# Altium schematic sheet Sheet1 - Copy.SchDoc
size A
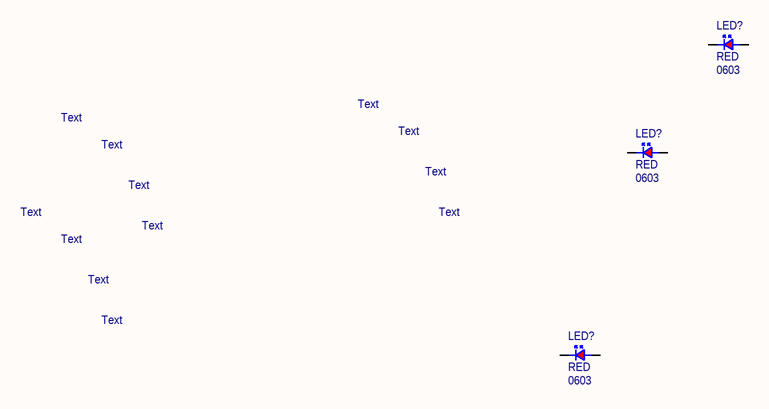
[diagram p0: Sheet1 - Copy.SchDoc]

## Parts
(Parts that share a designator on the sheet are numbered #1, #2 ... from top to bottom, then left to right.)
LED?#1  PackageReference: 0603  [LED0603_RED_LTST]  (hidden comment: RED)
LED?#2  PackageReference: 0603  [LED0603_RED_LTST]  (hidden comment: RED)
LED?#3  PackageReference: 0603  [LED0603_RED_LTST]  (hidden comment: RED)

## Nets

Not connected (* = marked no-connect by the designer): LED?#1 1(K) 2(A); LED?#2 1(K) 2(A); LED?#3 1(K) 2(A)

## Notes on the sheet
- Text

## Library data of the parts
LED?#1-LED?#3 = E1052: LED RED CLEAR SMD 2V 0603; KEY: E1052; n: 53; item_category: Diodes; OpTemp: -55~85C; MaxHeightAboveBoard: 0.55mm; MFG1: Lite-On; MFG1PN: LTST-C191KRKT; UnitPrice1K: 0.056; Component1LinkDescription: Datasheet; Component2LinkDescription: Supplier Part Details; Value: RED; item_category_subtype: LED; item_number: *; Assembly: *; Supplier1: Digi-Key; Supplier1PN: 160-1447-1-ND; Supplier2: *; Supplier2PN: *; Supplier3: *; Supplier3PN: *; Component1LinkURL: http://optoelectronics.liteon.com/upload/download/DS22-2000-223/LTST-C191KRKT.PDF; Component2LinkURL: https://www.digikey.com/product-detail/en/lite-on-inc/LTST-C191KRKT/160-1447-1-ND/386836; Component Type: Standard; CreatedBy: SL; CreatedDate: 2/19/19; UpdatedBy: *; UpdatedDate: *; UpdateComment: *; Revision: 0; Note: *; Feature: *; Cost: *; Config: *